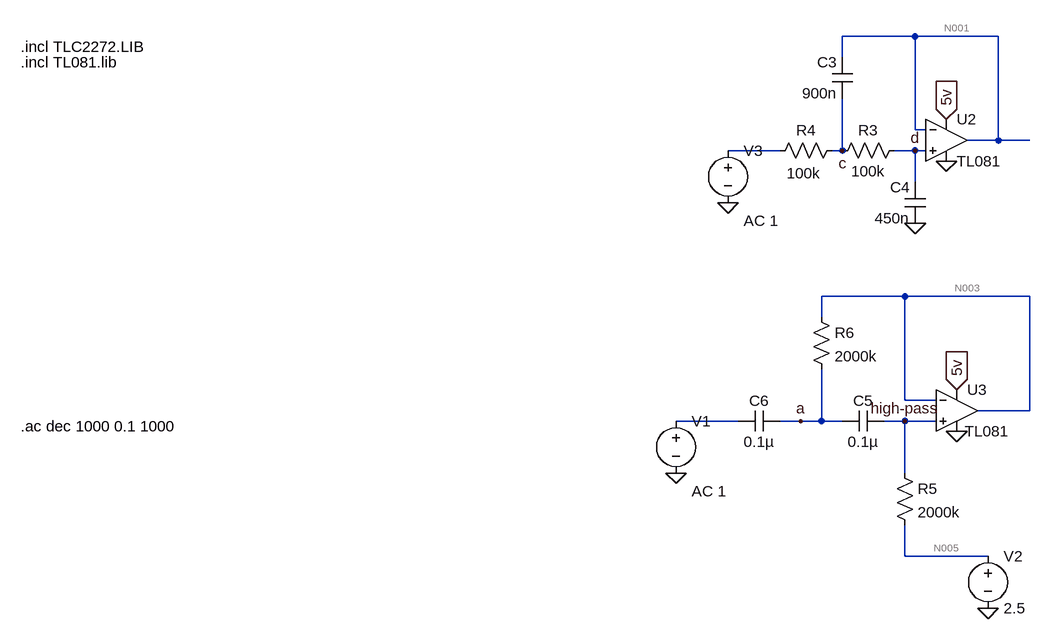
[diagram p0: schematic Draft3.asc]
Draft3.asc, the LTspice schematic file:
Version 4
SHEET 1 1356 820
WIRE 960 -80 848 -80
WIRE 1088 -80 960 -80
WIRE 848 -48 848 -80
WIRE 960 64 960 -80
WIRE 976 64 960 64
WIRE 1088 80 1088 -80
WIRE 1088 80 1040 80
WIRE 1136 80 1088 80
WIRE 752 96 672 96
WIRE 848 96 848 16
WIRE 848 96 832 96
WIRE 960 96 928 96
WIRE 976 96 960 96
WIRE 960 144 960 96
WIRE 944 320 816 320
WIRE 1136 320 944 320
WIRE 816 352 816 320
WIRE 944 480 944 320
WIRE 992 480 944 480
WIRE 1136 496 1136 320
WIRE 1136 496 1056 496
WIRE 688 512 592 512
WIRE 784 512 752 512
WIRE 816 512 816 432
WIRE 816 512 784 512
WIRE 848 512 816 512
WIRE 944 512 912 512
WIRE 992 512 944 512
WIRE 944 592 944 512
WIRE 944 720 944 672
WIRE 1072 720 944 720
FLAG 592 592 0
FLAG 1008 112 0
FLAG 1008 48 5v
IOPIN 1008 48 In
FLAG 1024 464 5v
IOPIN 1024 464 In
FLAG 1024 528 0
FLAG 784 512 a
FLAG 944 512 high-pass
FLAG 848 96 c
FLAG 960 96 d
FLAG 1072 800 0
FLAG 672 176 0
FLAG 960 208 0
SYMBOL voltage 592 496 R0
WINDOW 123 24 124 Left 2
WINDOW 39 0 0 Left 0
SYMATTR Value2 AC 1
SYMATTR InstName V1
SYMATTR Value ""
SYMBOL res 944 80 R90
WINDOW 0 0 56 VBottom 2
WINDOW 3 32 56 VTop 2
SYMATTR InstName R3
SYMATTR Value 100k
SYMBOL res 848 80 R90
WINDOW 0 0 56 VBottom 2
WINDOW 3 35 59 VTop 2
SYMATTR InstName R4
SYMATTR Value 100k
SYMBOL cap 864 16 R180
WINDOW 0 24 56 Left 2
WINDOW 3 24 8 Left 2
SYMATTR InstName C3
SYMATTR Value 900n
SYMBOL cap 976 208 R180
WINDOW 0 24 56 Left 2
WINDOW 3 24 8 Left 2
SYMATTR InstName C4
SYMATTR Value 450n
SYMBOL Opamps\\opamp2 1008 16 R0
SYMATTR InstName U2
SYMATTR Value TL081
SYMBOL Opamps\\opamp2 1024 432 R0
WINDOW 3 12 96 Left 2
SYMATTR Value TL081
SYMATTR InstName U3
SYMBOL res 928 576 R0
SYMATTR InstName R5
SYMATTR Value 2000k
SYMBOL res 800 336 R0
SYMATTR InstName R6
SYMATTR Value 2000k
SYMBOL cap 912 496 R90
WINDOW 0 0 32 VBottom 2
WINDOW 3 32 32 VTop 2
SYMATTR InstName C5
SYMATTR Value 0.1µ
SYMBOL cap 752 496 R90
WINDOW 0 0 32 VBottom 2
WINDOW 3 32 32 VTop 2
SYMATTR InstName C6
SYMATTR Value 0.1µ
SYMBOL voltage 1072 704 R0
WINDOW 123 0 0 Left 0
WINDOW 39 0 0 Left 0
SYMATTR InstName V2
SYMATTR Value 2.5
SYMBOL voltage 672 80 R0
WINDOW 123 24 124 Left 2
WINDOW 39 0 0 Left 0
SYMATTR Value2 AC 1
SYMATTR InstName V3
SYMATTR Value ""
TEXT -416 -64 Left 2 !.incl TLC2272.LIB
TEXT -416 -40 Left 2 !.incl TL081.lib
TEXT -416 520 Left 2 !.ac dec 1000 0.1 1000

The netlist it stands for:
* Draft3.asc
V1 N004 0 AC 1
R3 d c 100k
R4 c N002 100k
C3 c N001 900n
C4 0 d 450n
XU2 d N001 5v 0 N001 TL081  ; pins In+ In- V+ V- OUT
XU3 high-pass N003 5v 0 N003 TL081  ; pins In+ In- V+ V- OUT
R5 high-pass N005 2000k
R6 N003 a 2000k
C5 high-pass a 0.1µ
C6 a N004 0.1µ
V2 N005 0 2.5
V3 N002 0 AC 1
.incl TLC2272.LIB
.incl TL081.lib
.ac dec 1000 0.1 1000
.backanno
.end

* Results of the author's LTspice run, read from the files saved beside the schematic
* Operating Point, zero values left out:
*   V(d) = 505.1 mV
*   V(c) = 252.6 mV
*   V(n001) = 1.467 V
*   V(5v) = 2.937 V
*   V(n003) = 1.47 V
*   V(high-pass) = 2.5 V
*   V(n005) = 2.5 V
*   V(a) = 1.47 V
*   I(R5) = -33.65 pA
*   I(R4) = 2.526 µA
*   I(R3) = 2.526 µA
*   I(V3) = 2.526 µA
*   I(V2) = -33.65 pA
*   Ix(u2:1) = -2.526 µA
*   Ix(u2:2) = 32 pA
*   Ix(u2:3) = 76.78 µA
*   Ix(u2:4) = 45.11 µA
*   Ix(u2:5) = 80.18 pA
*   Ix(u3:1) = 33.65 pA
*   Ix(u3:2) = 30.77 pA
*   Ix(u3:3) = -76.78 µA
*   Ix(u3:4) = -107.3 µA
*   Ix(u3:5) = -815.4 pA
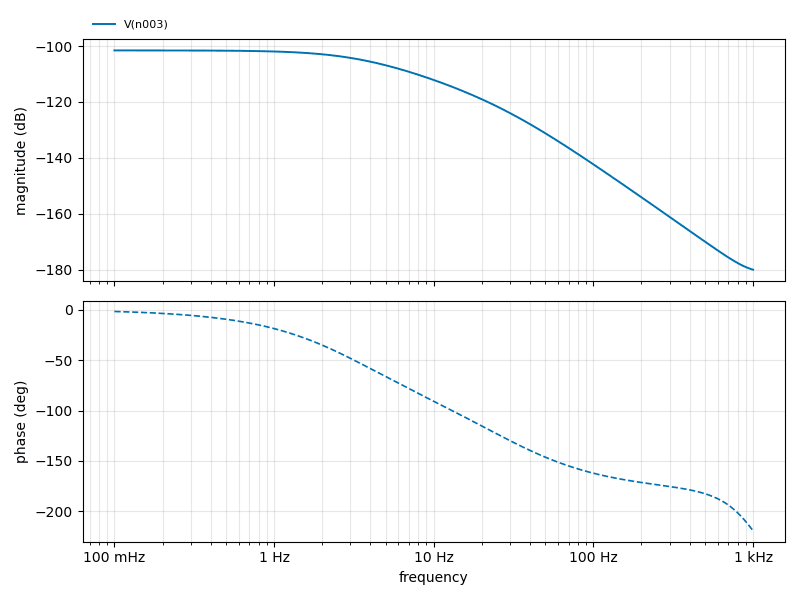
[diagram p1: AC Analysis of Draft3.asc, plotted from the saved traces]
* AC Analysis, 1 run:
*   V(n003): -101.55 dB at 100 mHz, -180.06 dB at 1 kHz, peak -101.55 dB at 100 mHz, 3 dB below the peak at 3.252 Hz